# Altium schematic sheet 0_ADSTM32-Overview.SchDoc
size A4; SheetNumber: 1; SheetTotal: 4
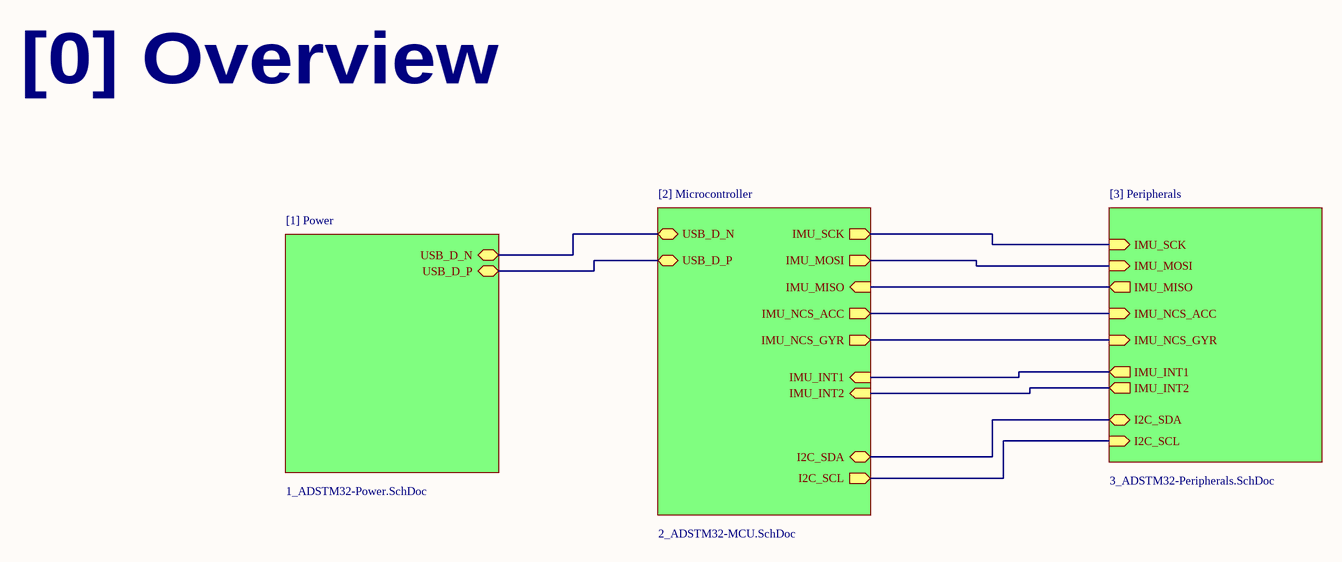
[diagram p0: 0_ADSTM32-Overview.SchDoc]

## Sub-sheets
[1] Power = 1_ADSTM32-Power.SchDoc: USB_D_N (bidir), USB_D_P (bidir)
[2] Microcontroller = 2_ADSTM32-MCU.SchDoc: USB_D_N (bidir), USB_D_P (bidir), IMU_SCK (out), IMU_MOSI (out), IMU_MISO (in), IMU_NCS_ACC (out), IMU_NCS_GYR (out), I2C_SDA (bidir), IMU_INT1 (in), IMU_INT2 (in), I2C_SCL (out)
[3] Peripherals = 3_ADSTM32-Peripherals.SchDoc: IMU_SCK (in), IMU_MOSI (in), IMU_MISO (out), IMU_NCS_ACC (in), IMU_NCS_GYR (in), I2C_SDA (bidir), IMU_INT1 (out), IMU_INT2 (out), I2C_SCL (in)

## Nets
(unnamed): sheet [1] Power/USB_D_N, sheet [2] Microcontroller/USB_D_N
(unnamed): sheet [1] Power/USB_D_P, sheet [2] Microcontroller/USB_D_P
(unnamed): sheet [2] Microcontroller/IMU_SCK, sheet [3] Peripherals/IMU_SCK
(unnamed): sheet [2] Microcontroller/IMU_MOSI, sheet [3] Peripherals/IMU_MOSI
(unnamed): sheet [2] Microcontroller/IMU_MISO, sheet [3] Peripherals/IMU_MISO
(unnamed): sheet [2] Microcontroller/IMU_NCS_ACC, sheet [3] Peripherals/IMU_NCS_ACC
(unnamed): sheet [2] Microcontroller/IMU_NCS_GYR, sheet [3] Peripherals/IMU_NCS_GYR
(unnamed): sheet [2] Microcontroller/I2C_SDA, sheet [3] Peripherals/I2C_SDA
(unnamed): sheet [2] Microcontroller/IMU_INT1, sheet [3] Peripherals/IMU_INT1
(unnamed): sheet [2] Microcontroller/IMU_INT2, sheet [3] Peripherals/IMU_INT2
(unnamed): sheet [2] Microcontroller/I2C_SCL, sheet [3] Peripherals/I2C_SCL

## Notes on the sheet
- [0] Overview